# EAGLE schematic 3_phase_sense (EAGLE 6.5.0)
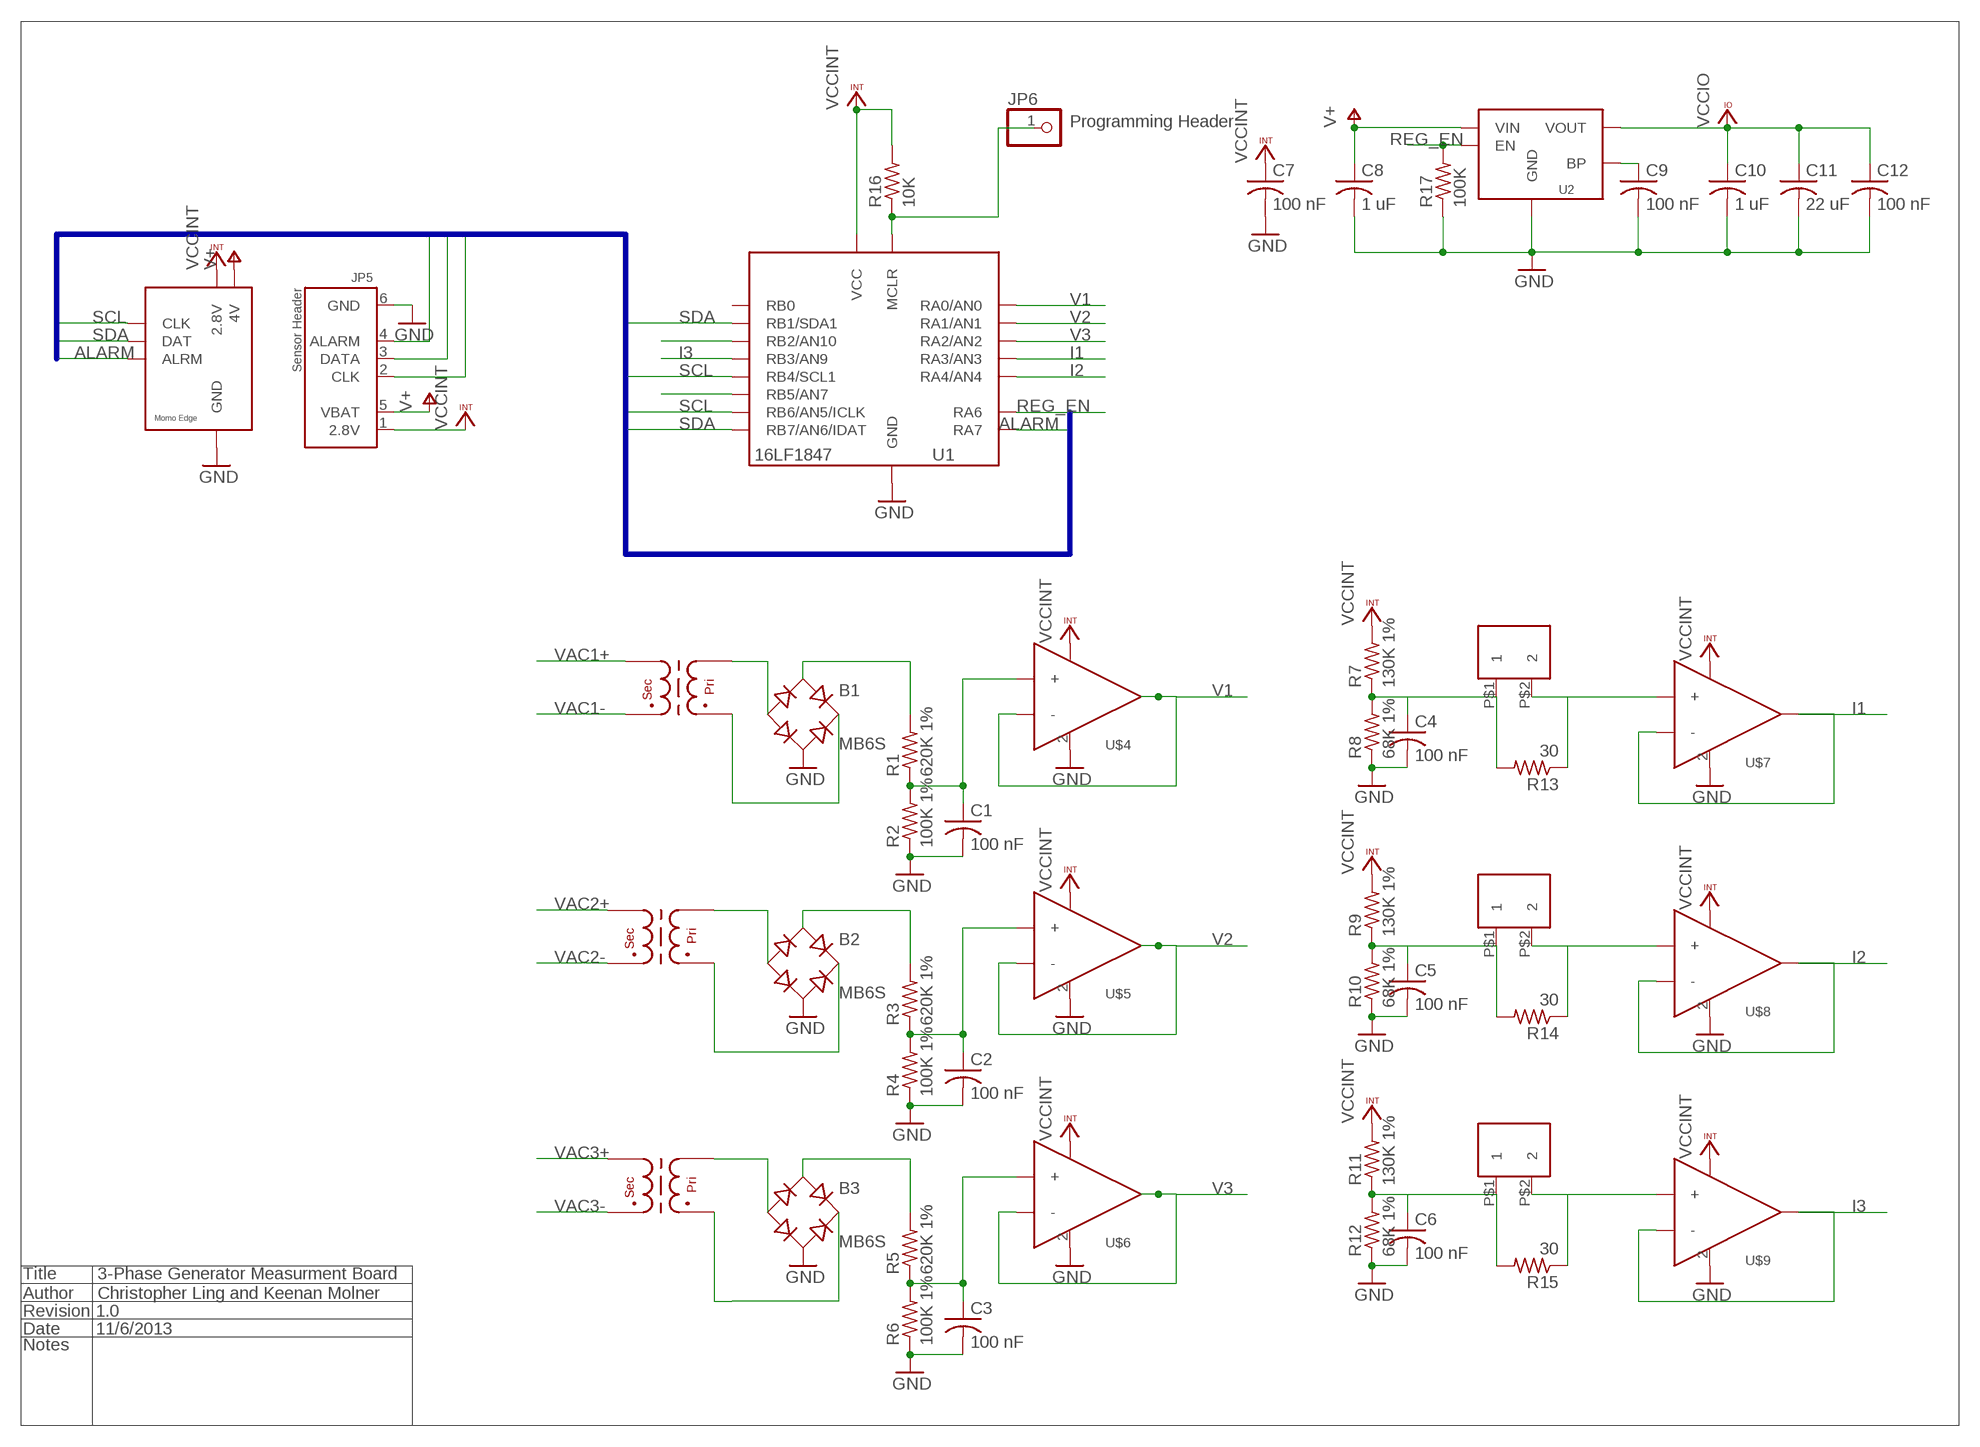
[diagram p0: schematic, sheet 1]

## Parts
B1  MB6S  [SOIC-4]
B2  MB6S  [SOIC-4]
B3  MB6S  [SOIC-4]
C1  100 nF  C-USC0402K  [C0402K]
C2  100 nF  C-USC0402K  [C0402K]
C3  100 nF  C-USC0402K  [C0402K]
C4  100 nF  C-USC0402K  [C0402K]
C5  100 nF  C-USC0402K  [C0402K]
C6  100 nF  C-USC0402K  [C0402K]
C7  100 nF  C-USC0402K  [C0402K]
C8  1 uF  C-USC0402K  [C0402K]
C9  100 nF  C-USC0402K  [C0402K]
C10  1 uF  C-USC0402K  [C0402K]
C11  22 uF  C-USC1206K  [C1206K]
C12  100 nF  C-USC0402K  [C0402K]
JP1  5MM-SCREWTERM-2POS  [5MM-SCREWTERM]
JP2  5MM-SCREWTERM-2POS  [5MM-SCREWTERM]
JP3  5MM-SCREWTERM-2POS  [5MM-SCREWTERM]
JP4  MOMO-VERT-6M  [1X06]
JP5  MOMO-SENSOR-RJ11  [RJ-12]
JP6  PINHD-1X1  [1X01]
R1  620K 1%  R-US_R0603  [R0603]
R2  100K 1%  R-US_R0603  [R0603]
R3  620K 1%  R-US_R0603  [R0603]
R4  100K 1%  R-US_R0603  [R0603]
R5  620K 1%  R-US_R0603  [R0603]
R6  100K 1%  R-US_R0603  [R0603]
R7  130K 1%  R-US_R0603  [R0603]
R8  68K 1%  R-US_R0603  [R0603]
R9  130K 1%  R-US_R0603  [R0603]
R10  68K 1%  R-US_R0603  [R0603]
R11  130K 1%  R-US_R0603  [R0603]
R12  68K 1%  R-US_R0603  [R0603]
R13  30  R-US_R2512  [R2512]
R14  30  R-US_R2512  [R2512]
R15  30  R-US_R2512  [R2512]
R16  10K  R-US_R0603  [R0603]
R17  100K  R-US_R0603  [R0603]
U1  PIC1847  [SSOP20]
U2  AP7115-LDO  [SOT353]
U$1  CJ5143-AL  [CJ5143-AL]
U$2  CJ5143-AL  [CJ5143-AL]
U$3  CJ5143-AL  [CJ5143-AL]
U$4  NJU7011F  [SOT23-5L]
U$5  NJU7011F  [SOT23-5L]
U$6  NJU7011F  [SOT23-5L]
U$7  NJU7011F  [SOT23-5L]
U$8  NJU7011F  [SOT23-5L]
U$9  NJU7011F  [SOT23-5L]

## Nets
ALARM: JP4.5(ALRM) JP5.4(ALARM) U1.17(RA7)
GND: B1.~2(AC2) B2.~2(AC2) B3.~2(AC2) C1.2 C2.2 C3.2 C4.2 C5.2 C6.2 C7.2 C8.2 C9.2 C10.2 C11.2 C12.2 JP4.7(GND) JP5.6(GND) R2.1 R4.1 R6.1 R8.1 R10.1 R12.1 R17.1 U1.15(GND) U1.16(GND) U2.2(GND) U$4.2(VSS) U$5.2(VSS) U$6.2(VSS) U$7.2(VSS) U$8.2(VSS) U$9.2(VSS)
I1: U1.2(RA3/AN3) U$7.3(-) U$7.5(OUT)
I2: U1.3(RA4/AN4) U$8.3(-) U$8.5(OUT)
I3: U1.10(RB3/AN9) U$9.3(-) U$9.5(OUT)
N$1: U1.12(RB5/AN7)
N$2: U1.9(RB2/AN10)
N$3: C9.1 U2.4(BP)
N$4: JP6.1 R16.1 U1.4(MCLR)
N$5: JP1.P$2 R13.1 U$7.1(+)
N$6: JP2.P$2 R14.1 U$8.1(+)
N$7: B1.~1(AC1) R1.2
N$8: JP3.P$2 R15.1 U$9.1(+)
N$9: B1.- U$1.P$4
N$10: B1.+ U$1.P$1
N$11: B2.~1(AC1) R3.2
N$12: B2.- U$2.P$4
N$13: B2.+ U$2.P$1
N$14: B3.~1(AC1) R5.2
N$15: B3.- U$3.P$4
N$16: B3.+ U$3.P$1
REG_EN: R17.2 U1.18(RA6) U2.3(EN)
SCL: JP4.3(CLK) JP5.2(CLK) U1.11(RB4/SCL1) U1.13(RB6/AN5/ICLK)
SDA: JP4.4(DAT) JP5.3(DATA) U1.8(RB1/SDA1) U1.14(RB7/AN6/IDAT)
V1: U1.19(RA0/AN0) U$4.3(-) U$4.5(OUT)
V1_UNBUFF: C1.1 R1.1 R2.2 U$4.1(+)
V1_UNBUFF1: C2.1 R3.1 R4.2 U$5.1(+)
V1_UNBUFF2: C3.1 R5.1 R6.2 U$6.1(+)
V2: C4.1 JP1.P$1 R7.1 R8.2 R13.2 U1.20(RA1/AN1) U$5.3(-) U$5.5(OUT)
V3: U1.1(RA2/AN2) U$6.3(-) U$6.5(OUT)
V4: C5.1 JP2.P$1 R9.1 R10.2 R14.2
V5: C6.1 JP3.P$1 R11.1 R12.2 R15.2
V+: C8.1 JP4.6(4V) JP5.5(VBAT) U2.1(VIN)
VAC1+: U$1.P$5
VAC1-: U$1.P$6
VAC2+: U$2.P$5
VAC2-: U$2.P$6
VAC3+: U$3.P$5
VAC3-: U$3.P$6
VCCINT: C7.1 JP4.1(2.8V) JP5.1(2.8V) R7.2 R9.2 R11.2 R16.2 U1.5(VCC) U1.6(VCC) U$4.4(VDD) U$5.4(VDD) U$6.4(VDD) U$7.4(VDD) U$8.4(VDD) U$9.4(VDD)
VCCIO: C10.1 C11.1 C12.1 U2.5(VOUT)
Unconnected: U1.7(RB0)

## Buses
MIB:SDA,SCL,ALARM

## Notes on the sheet
- Programming Header
- Title | 3-Phase Generator Measurment Board
- Author | Christopher Ling and Keenan Molner
- Revision | 1.0
- Date | 11/6/2013
- Notes

## Library data of the parts
B1-B3 = rectifier:MB*S: Bridge Rectifier Source: http://www.fairchildsemi.com/ds/MB/MB6S.pdf
C1-C7 C9 C12 = rcl:C-US: CAPACITOR, American symbol; DIGIKEY-PN: 445-1265-1-ND
C8 C10 = rcl:C-US: CAPACITOR, American symbol; DIGIKEY-PN: 445-4114-1-ND
C11 = rcl:C-US: CAPACITOR, American symbol; DIGIKEY-PN: 478-3865-1-ND
JP1-JP3 = components:5MM-SCREWTERM-2POS; DESCRIPTION: 2 position screw terminal; DIGIKEY-PN: 277-1667-ND; FOOTPRINT: Through Hole
JP4 = components:MOMO-VERT-6M; DIGIKEY-PN: S7004-ND
JP5 = components:MOMO-SENSOR-RJ11; DIGIKEY-PN: AE10383-ND
JP6 = pinhead:PINHD-1X1: PIN HEADER
R1 R3 R5 R7 R9 R11 = rcl:R-US_: RESISTOR, American symbol; DIGIKEY-PN: P620KHCT-ND
R2 R4 R6 R8 R10 R12 R17 = rcl:R-US_: RESISTOR, American symbol; DIGIKEY-PN: P100KHCT-ND
R13-R15 = rcl:R-US_: RESISTOR, American symbol; DIGIKEY-PN: CRF2512-FV-R001ELFCT-ND
R16 = rcl:R-US_: RESISTOR, American symbol; DIGIKEY-PN: P10.0KHCT-ND
U1 = components:PIC1847
U2 = components:AP7115-LDO; DIGIKEY-PN: AP7115-28SEGDICT-ND
U$1-U$3 = components:CJ5143-AL
U$4-U$9 = components:NJU7011F